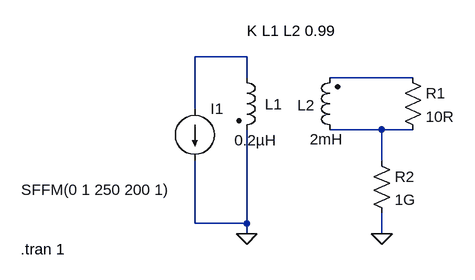
[diagram p0: schematic Current sense transformers - Lower Acceptable Frequency demo.asc]
Current sense transformers - Lower Acceptable Frequency demo.asc, the LTspice schematic file:
Version 4
SHEET 1 880 680
WIRE 80 96 0 96
WIRE 80 128 80 96
WIRE 336 128 208 128
WIRE 0 176 0 96
WIRE 288 208 208 208
WIRE 336 208 288 208
WIRE 288 256 288 208
WIRE 0 352 0 256
WIRE 80 352 80 208
WIRE 80 352 0 352
WIRE 80 368 80 352
WIRE 288 368 288 336
FLAG 80 368 0
FLAG 288 368 0
SYMBOL ind2 64 112 R0
WINDOW 0 44 57 Left 2
WINDOW 3 -3 112 Left 2
SYMATTR InstName L1
SYMATTR Value 0.2µH
SYMATTR Type ind
SYMBOL ind2 224 224 R180
WINDOW 0 39 54 Left 2
WINDOW 3 -4 1 Left 2
SYMATTR InstName L2
SYMATTR Value 2mH
SYMATTR Type ind
SYMBOL current 0 176 R0
WINDOW 3 -267 124 Left 2
WINDOW 123 0 0 Left 0
WINDOW 39 0 0 Left 0
SYMATTR InstName I1
SYMATTR Value SFFM(0 1 250 200 1)
SYMBOL res 320 112 R0
SYMATTR InstName R1
SYMATTR Value 10R
SYMBOL res 272 240 R0
SYMATTR InstName R2
SYMATTR Value 1G
TEXT 80 56 Left 2 !K L1 L2 0.99
TEXT -268 392 Left 2 !.tran 1

The netlist it stands for:
* Current sense transformers - Lower Acceptable Frequency demo.asc
L1 N001 0 0.2µH
L2 N003 N002 2mH
I1 N001 0 SFFM(0 1 250 200 1)
R1 N002 N003 10R
R2 N003 0 1G
K L1 L2 0.99
.tran 1
.backanno
.end